# EAGLE schematic MCU (EAGLE 9.2.2)
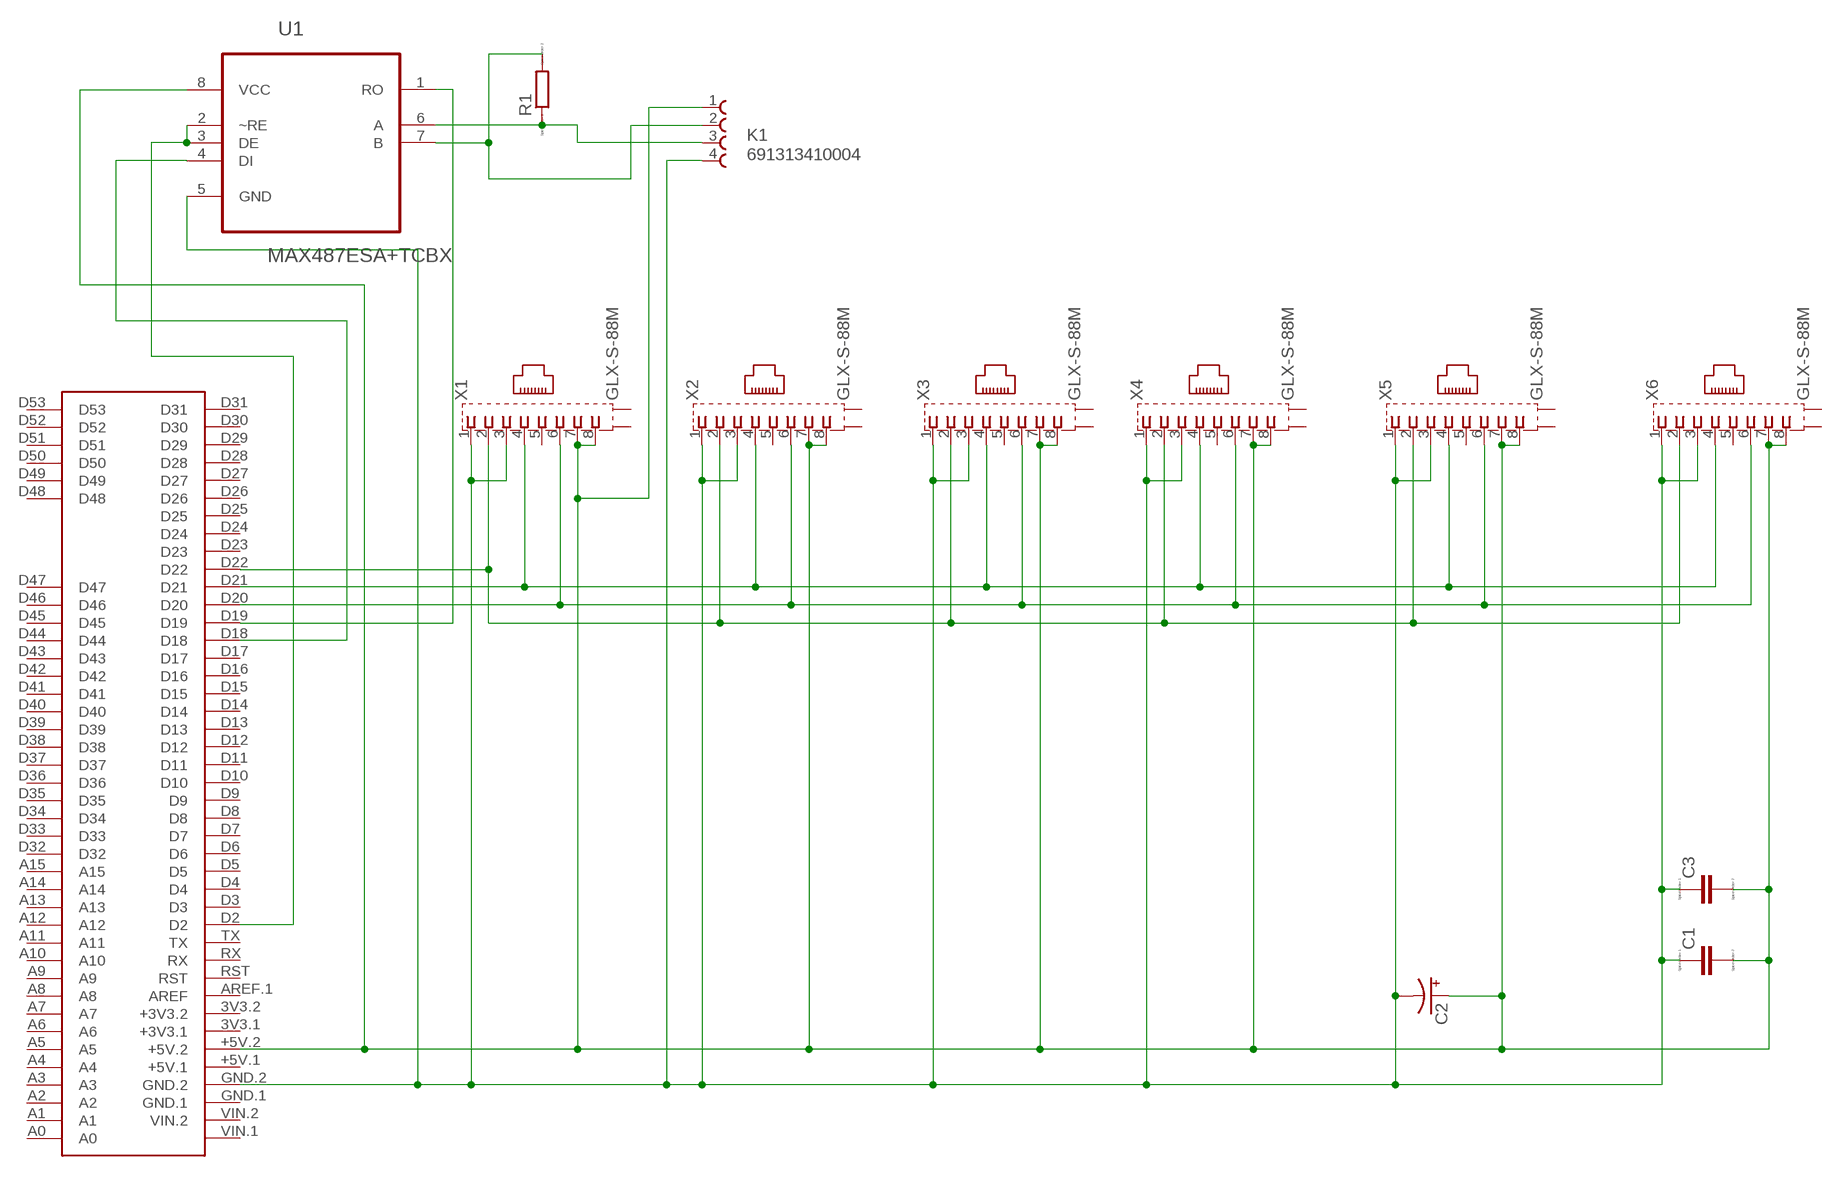
[diagram p0: schematic, sheet 1]

## Parts
C1  CC1206  [C1206]
C2  CPOL-US153CLV-0807  [153CLV-0807]
C3  CC1206  [C1206]
K1  691313410004  [691313410004]
R1  RR1206  [R1206]
U1  MAX487ESA+TCBX  [SOIC127P600X175-8N]
U$1  MEGA2560_MIKRO  [MEGA2560_MIKRO]
X1  GLX-S-88M  [GLX-S-88M]
X2  GLX-S-88M  [GLX-S-88M]
X3  GLX-S-88M  [GLX-S-88M]
X4  GLX-S-88M  [GLX-S-88M]
X5  GLX-S-88M  [GLX-S-88M]
X6  GLX-S-88M  [GLX-S-88M]

## Nets
N$1: U1.4(DI) U$1.D18
N$2: U1.1(RO) U$1.D19
N$3: U1.2(~RE) U1.3(DE) U$1.D2
N$4: K1.3 R1.1 U1.6(A)
N$5: K1.2 R1.2 U1.7(B)
N$6: C1.1 C2.- C3.1 K1.4 U1.5(GND) U$1.GND.2 X1.1 X1.3 X2.1 X2.3 X3.1 X3.3 X4.1 X4.3 X5.1 X5.3 X6.1 X6.3
N$12: C1.2 C2.+ C3.2 K1.1 U1.8(VCC) U$1.+5V.2 X1.7 X1.8 X2.7 X2.8 X3.7 X3.8 X4.7 X4.8 X5.7 X5.8 X6.7 X6.8
N$13: U$1.D22 X1.2 X2.2 X3.2 X4.2 X5.2 X6.2
N$14: U$1.D20 X1.6 X2.6 X3.6 X4.6 X5.6 X6.6
N$15: U$1.D21 X1.4 X2.4 X3.4 X4.4 X5.4 X6.4
Unconnected: U$1.3V3.1(+3V3.1) U$1.3V3.2(+3V3.2) U$1.+5V.1 U$1.A0 U$1.A1 U$1.A2 U$1.A3 U$1.A4 U$1.A5 U$1.A6 U$1.A7 U$1.A8 U$1.A9 U$1.A10 U$1.A11 U$1.A12 U$1.A13 U$1.A14 U$1.A15 U$1.AREF.1(AREF) U$1.D3 U$1.D4 U$1.D5 U$1.D6 U$1.D7 U$1.D8 U$1.D9 U$1.D10 U$1.D11 U$1.D12 U$1.D13 U$1.D14 U$1.D15 U$1.D16 U$1.D17 U$1.D23 U$1.D24 U$1.D25 U$1.D26 U$1.D27 U$1.D28 U$1.D29 U$1.D30 U$1.D31 U$1.D32 U$1.D33 U$1.D34 U$1.D35 U$1.D36 U$1.D37 U$1.D38 U$1.D39 U$1.D40 U$1.D41 U$1.D42 U$1.D43 U$1.D44 U$1.D45 U$1.D46 U$1.D47 U$1.D48 U$1.D49 U$1.D50 U$1.D51 U$1.D52 U$1.D53 U$1.GND.1 U$1.RST U$1.RX U$1.TX U$1.VIN.1 U$1.VIN.2 X1.5 X1.S1 X1.S2 X2.5 X2.S1 X2.S2 X3.5 X3.S1 X3.S2 X4.5 X4.S1 X4.S2 X5.5 X5.S1 X5.S2 X6.5 X6.S1 X6.S2

## Library data of the parts
C1 C3 = eagle-ltspice:C: CAPACITOR, European symbol; SPICEMODEL: NONE; SPICEPREFIX: C
C2 = adafruit:CPOL-US: POLARIZED CAPACITOR, American symbol
K1 = Wurth_Elektronik_Electromechanic_Terminal_Blocks_Connectors_rev15c:691313410004: WR-TBL Serie 3134 - 7.62 mm Open Horizontal PCB Header , 4 Pins=>Code : Con_TBL_Pluggable_7.62_PCB_H_691313410004 <http://katalog.we-online.de/media/images/eican/Con_TBL_Pluggable_7.62_PCB_H_6913134100xx_pf2.jpg> Details see: http://katalog.we-online.de/en/em/691_313_410_0xx Created 2014-06-25, Karrer Zheng 2014 (C) Würth Elektronik
R1 = eagle-ltspice:R: RESISTOR, European symbol; SPICEMODEL: NONE; SPICEPREFIX: R
U1 = MAX487ESA_TCBX:MAX487ESA+TCBX: Low-Power, Slew-Rate-Limited RS-485/RS-422 Transceivers Check prices <https://pricing.snapeda.com/parts/MAX487ESA%2BTCBX/Maxim%20Integrated/view-part?ref=eda>; AVAILABILITY: Warning; DESCRIPTION: 1/1 Transceiver Half RS422, RS485 8-SOIC; MF: Maxim Integrated; MP: MAX487ESA+TCBX; PACKAGE: SOIC-8 Maxim Integrated; PRICE: None; PURCHASE-URL: https://pricing.snapeda.com/search/part/MAX487ESA+TCBX/?ref=eda
U$1 = MIKRO_MEGA2560:MEGA2560_MIKRO: Arduino Mega2560 pro robotDyn, create by mikroavr.com
X1-X6 = con-kycon:GLX-S-88M: Mod. Jack, Right Angle, 8 posiotion, 8 contatcs RJ45 Source: GLX-S-88M.pdf; OC_FARNELL: unknown; OC_NEWARK: unknown